# Altium schematic sheet Énigme1_Switch.SchDoc
size Tabloid; DocumentNumber: 4; SheetNumber: 4; SheetTotal: 7; Sheet_Name: Énigme2_Interrupteur; Size: 11x17; SPICEModelCache: <root> / <DocumentId>IJWHLXDW</DocumentId> / </root>
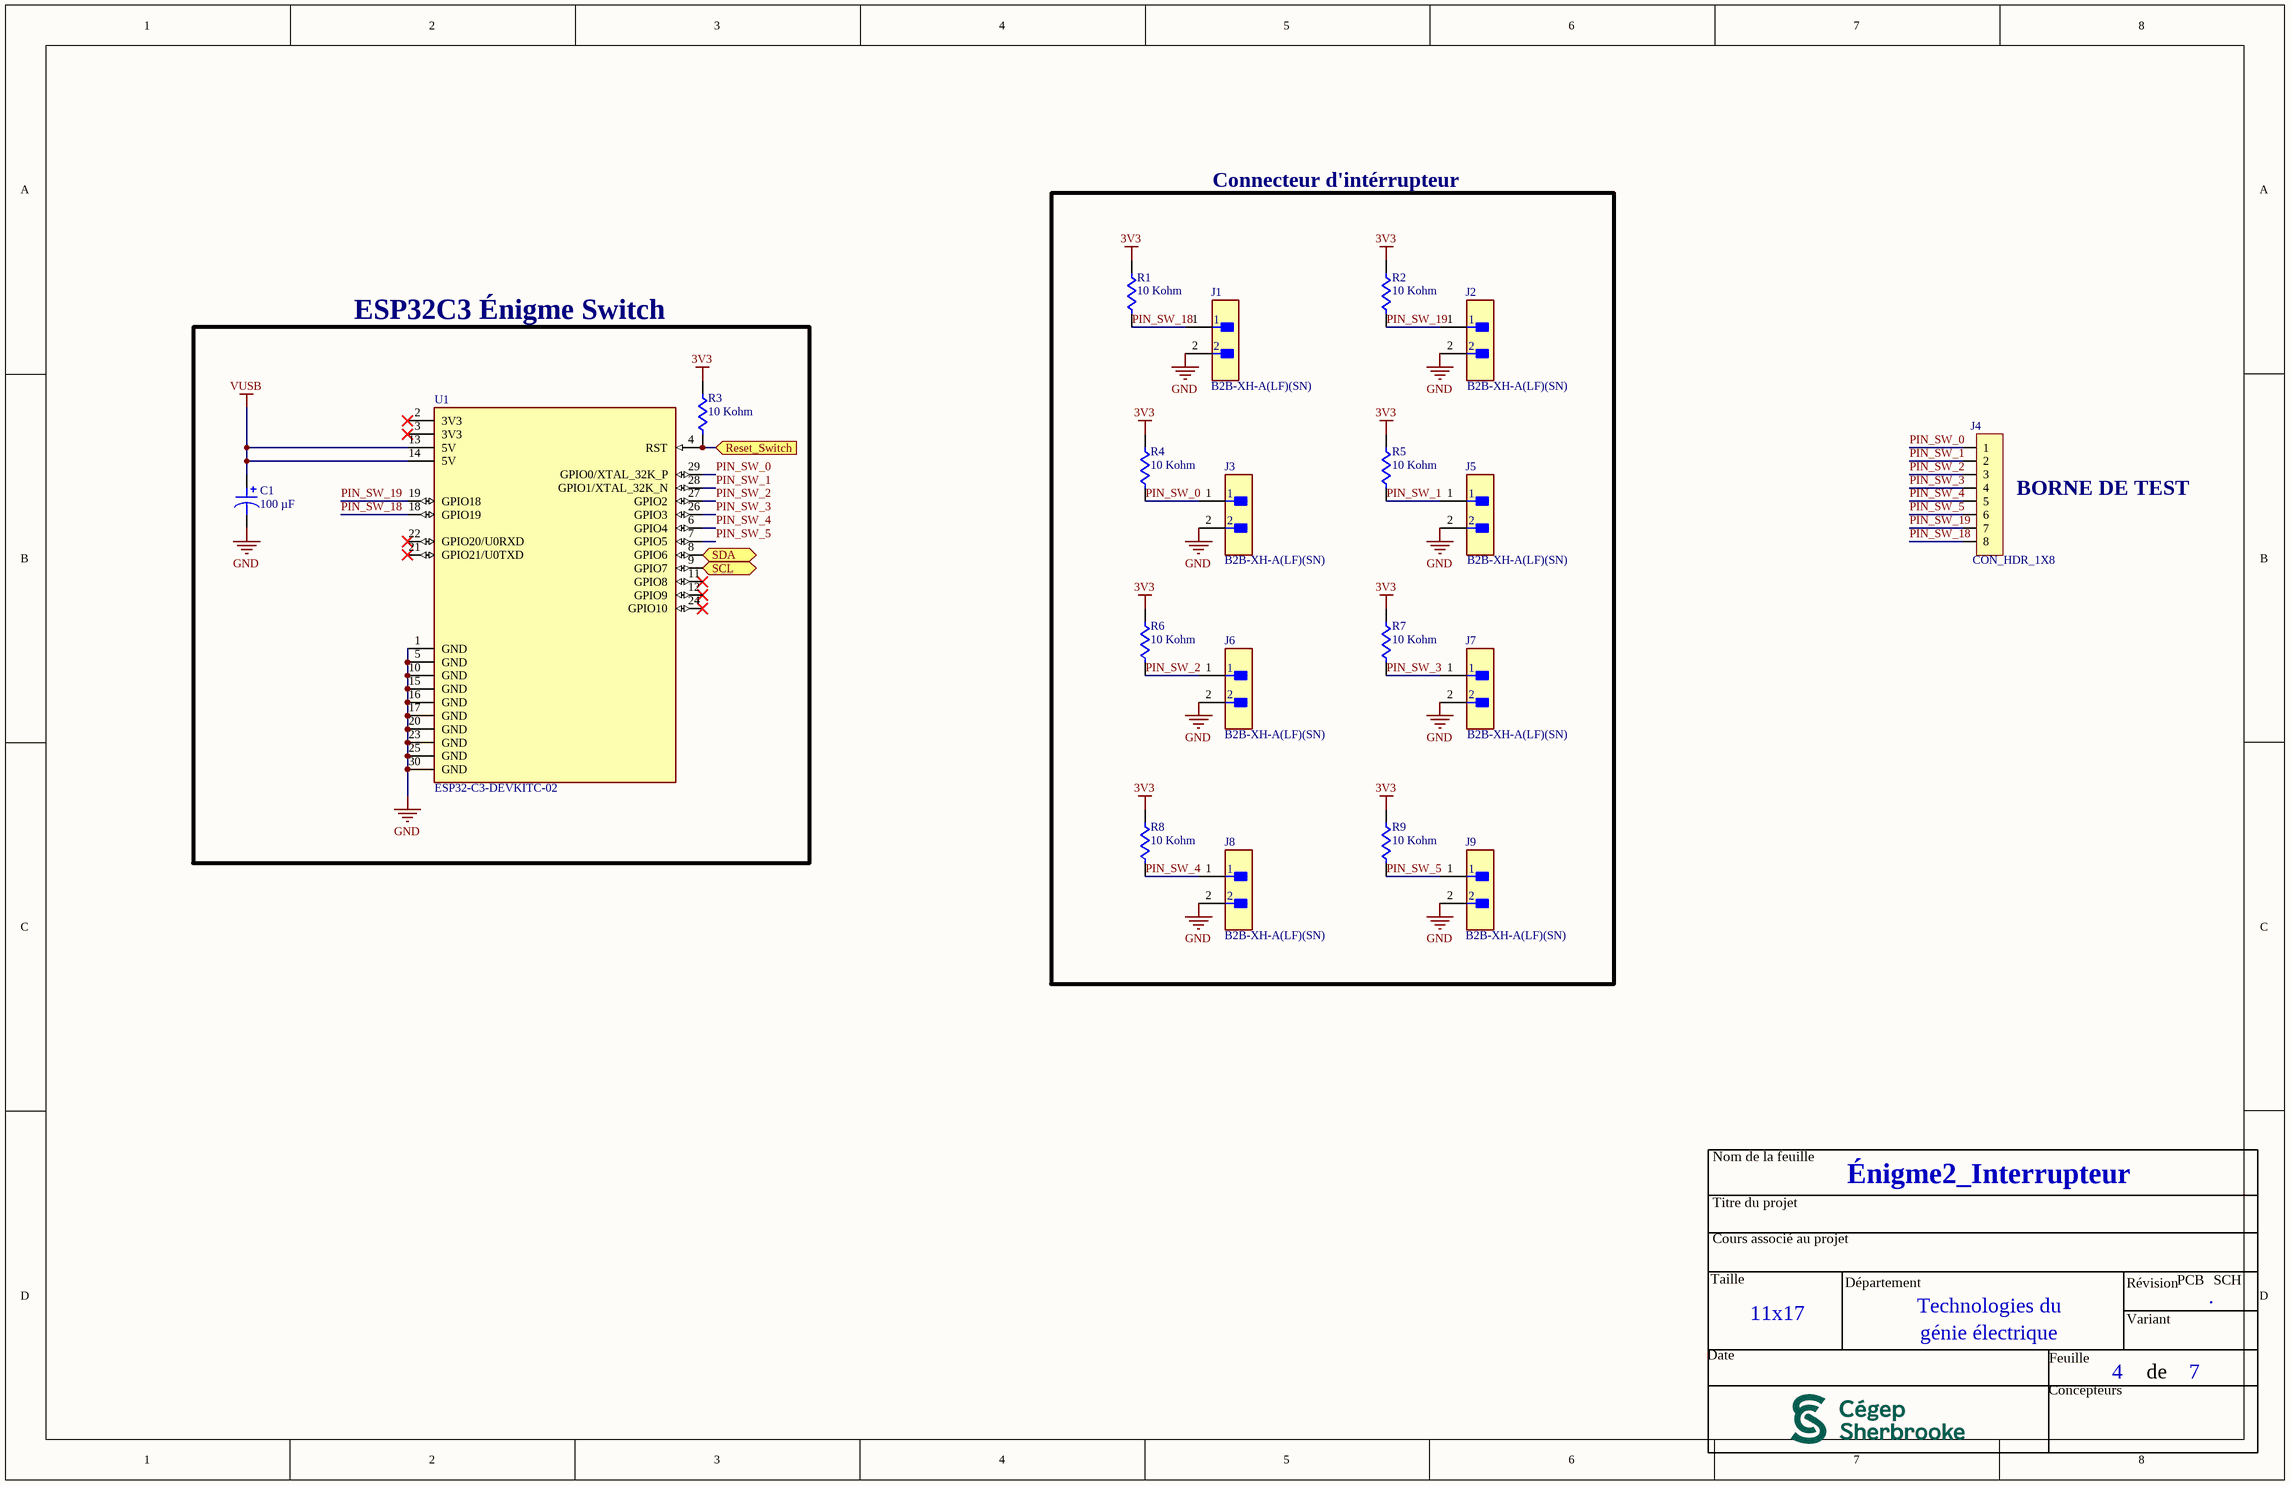
[diagram p0: Énigme1_Switch.SchDoc]

## Parts
C1  100 µF  [CAP AL TH D8 L3.5 H12.5]
J1  B2B-XH-A(LF)(SN)  [FP-B2B-XH-A_LF_SN-MFG]
J2  B2B-XH-A(LF)(SN)  [FP-B2B-XH-A_LF_SN-MFG]
J3  B2B-XH-A(LF)(SN)  [FP-B2B-XH-A_LF_SN-MFG]
J4  CON_HDR_1X8  [CON_HDR_1x8]
J5  B2B-XH-A(LF)(SN)  [FP-B2B-XH-A_LF_SN-MFG]
J6  B2B-XH-A(LF)(SN)  [FP-B2B-XH-A_LF_SN-MFG]
J7  B2B-XH-A(LF)(SN)  [FP-B2B-XH-A_LF_SN-MFG]
J8  B2B-XH-A(LF)(SN)  [FP-B2B-XH-A_LF_SN-MFG]
J9  B2B-XH-A(LF)(SN)  [FP-B2B-XH-A_LF_SN-MFG]
R1  10 Kohm  [Res_Template]
R2  10 Kohm  [Res_Template]
R3  10 Kohm  [Res_Template]
R4  10 Kohm  [Res_Template]
R5  10 Kohm  [Res_Template]
R6  10 Kohm  [Res_Template]
R7  10 Kohm  [Res_Template]
R8  10 Kohm  [Res_Template]
R9  10 Kohm  [Res_Template]
U1  ESP32-C3-DEVKITC-02  [XCVR_ESP32-C3-DEVKITC-02]

## Blocks framed on the sheet
Connecteur d'intérrupteur: J1-J3 J5-J9 R1 R2 R4-R9
ESP32C3 Énigme Switch: C1 R3 U1

## Ports
Reset_Switch (in), SCL (bidir), SDA (bidir)

## Nets
3V3: R1.2 R2.2 R3.2 R4.2 R5.2 R6.2 R7.2 R8.2 R9.2
GND: C1.2 J1.2 J2.2 J3.2 J5.2 J6.2 J7.2 J8.2 J9.2 U1.1(GND) U1.5(GND) U1.10(GND) U1.15(GND) U1.16(GND) U1.17(GND) U1.20(GND) U1.23(GND) U1.25(GND) U1.30(GND)
VUSB: C1.1 U1.13(5V) U1.14(5V)
PIN_SW_0: J3.1 J4.1 R4.1 U1.29(GPIO0/XTAL_32K_P)
PIN_SW_1: J4.2 J5.1 R5.1 U1.28(GPIO1/XTAL_32K_N)
PIN_SW_2: J4.3 J6.1 R6.1 U1.27(GPIO2)
PIN_SW_3: J4.4 J7.1 R7.1 U1.26(GPIO3)
PIN_SW_4: J4.5 J8.1 R8.1 U1.6(GPIO4)
PIN_SW_5: J4.6 J9.1 R9.1 U1.7(GPIO5)
PIN_SW_18: J1.1 J4.8 R1.1 U1.18(GPIO19)
PIN_SW_19: J2.1 J4.7 R2.1 U1.19(GPIO18)
Reset_Switch: R3.1 U1.4(RST) ; port Reset_Switch
SCL: U1.9(GPIO7) ; port SCL
SDA: U1.8(GPIO6) ; port SDA

Not connected (* = marked no-connect by the designer): U1 2(3V3)* 3(3V3)* 11(GPIO8)* 12(GPIO9)* 21(GPIO21/U0TXD)* 22(GPIO20/U0RXD)* 24(GPIO10)*

## Notes on the sheet
- (near J4) BORNE DE TEST
- Nom de la feuille
- Titre du projet
- Cours associé au projet
- Taille
- Département
- Technologies du
- Révision
- PCB
- .
- SCH
- Date
- génie électrique
- Feuille
- Variant
- de
- Concepteurs

## Library data of the parts
C1 = 860020674015: CAP ALUM 100UF 20% 50V RADIAL; manufacturer: Würth Elektronik; Lifetime @ Temp.: 2000 Hrs @ 105°C; Polarization: Polar; Ripple Current @ High Frequency: 306 mA @ 100 kHz; Ripple Current @ Low Frequency: 200 mA @ 120 Hz; Part Number: 860020674015; Applications: General Purpose; Capacitance: 100 µF; componentlink1description: Datasheet; componentlink1url: https://katalog.we-online.de/pbs/datasheet/860020674015.pdf; componentlink2description: DigiKey Link; componentlink2url: https://www.digikey.com/en/products/detail/würth-elektronik/860020674015/5727098; Device Package: Radial, Can; Height - Seated (Max): 0.492" (12.50mm); lastupdated: 2024-06-03 20:06:11; Lead Spacing: 0.138" (3.50mm); Lifecycle Status: Active; Minimum Order: 1; Mounting Type: Through Hole; Operating Temperature: -40°C ~ 105°C; Package / Case: Radial, Can; packaging: TapeAndBox; partid: 7238; Part Status: Active; price: 0.16; series: WCAP-ATG5; Size / Dimension: 0.315" Dia (8.00mm); Supplier 1: DigiKey; Supplier Part Number 1: 732-8861-1-ND; Tolerance: ±20%; value: 100 µF; Voltage - Rated: 50 V
J1-J3 J5-J9 = CMP-2000-05888-3: CONN HEADER VERT 2POS 2.5MM; Current Rating: 3A; Voltage Rating: 250V; Number of Contacts: 2; Contact Resistance: 20mR; Wire/Cable Gauge: 22AWG; Insulation Resistance: 1GR; Connector Type: Male Pin; Packaging: Bulk; Contact Material: Brass; Lead Free: Lead Free; Orientation: Straight; Contact Plating: Tin; Max Current Rating: 3A; Termination: Solder; Fastening Type: Detent; Depth: 5.75mm; Housing Material: Polyamide; REACH SVHC: No SVHC; Series: XH; Voltage Rating (AC): 250V; Number of Positions: 2; Color: Natural; Contact Type: Male Pin; Max Voltage Rating (DC): 250V; Pitch: 2.5mm; Lead Pitch: 2.5mm; Mount: Through Hole; Max Operating Temperature: 85°C; Length: 7.4mm; Max Voltage Rating (AC): 250V; Min Operating Temperature: -25°C; Number of Rows: 1; Housing Color: White
J4 = CMP-005-000004-1: CON - Header 1X8 pins, 100Mils - TH-8; Polarized: No; Note: *; Power Max: *; Component Type: Standard; Manufacturer #1: *; Design Item ID: CON_HDR_1X8; Assembly Type: TH; HelpURL: *; Pin Count: 8; Package: TH-8; Source: CEGEP_SHERBROOKE_TGE_LIBRARY.SchLib
R1-R9 = 470 ohm: Custom Semiconductor Resistor
U1 = ESP32-C3-DEVKITC-02: Development Boards & Kits - Wireless (Engineering Samples) ESP32-C3 General-Purpose Development Board, embeds ESP32-C3-WROOM-02, 4 MB Flash, with Pin Header; MF: Espressif Systems; Purchase-URL: https://www.digikey.ca/en/products/detail/espressif-systems/ESP32-C3-DEVKITC-02/14553009?gclsrc=aw.ds&&utm_adgroup=&utm_source=google&utm_medium=cpc&utm_campaign=PMax%20Product_Low%20ROAS%20Categories&utm_term=&productid=14553009&utm_content=&utm_id=go_cmp-20291741422_adg-_ad-__dev-c_ext-_prd-14553009_sig-CjwKCAiAh6y9BhBREiwApBLHC_cF2gDRygapSaJLXU2Wdnx3_ghIaBBBCKe6dQeqHq45MeITmry7OBoCG4EQAvD_BwE&gad_source=1&gclid=CjwKCAiAh6y9BhBREiwApBLHC_cF2gDRygapSaJLXU2Wdnx3_ghIaBBBCKe6dQeqHq45MeITmry7OBoCG4EQAvD_BwE; Package: None; MP: ESP32-C3-DevKitC-02; Price: 12.94$; Availability: In Stock; SnapEDA_Link: https://www.snapeda.com/parts/ESP32-C3-DevKitC-02/Espressif+Systems/view-part/?ref=snap; Check_prices: https://www.snapeda.com/parts/ESP32-C3-DevKitC-02/Espressif+Systems/view-part/?ref=eda; ComponentLink1Description: New link; ComponentLink1URL: https://docs.espressif.com/projects/esp-idf/en/v5.2/esp32c3/hw-reference/esp32c3/user-guide-devkitc-02.html